# EAGLE design version4 (EAGLE 9.6.2)
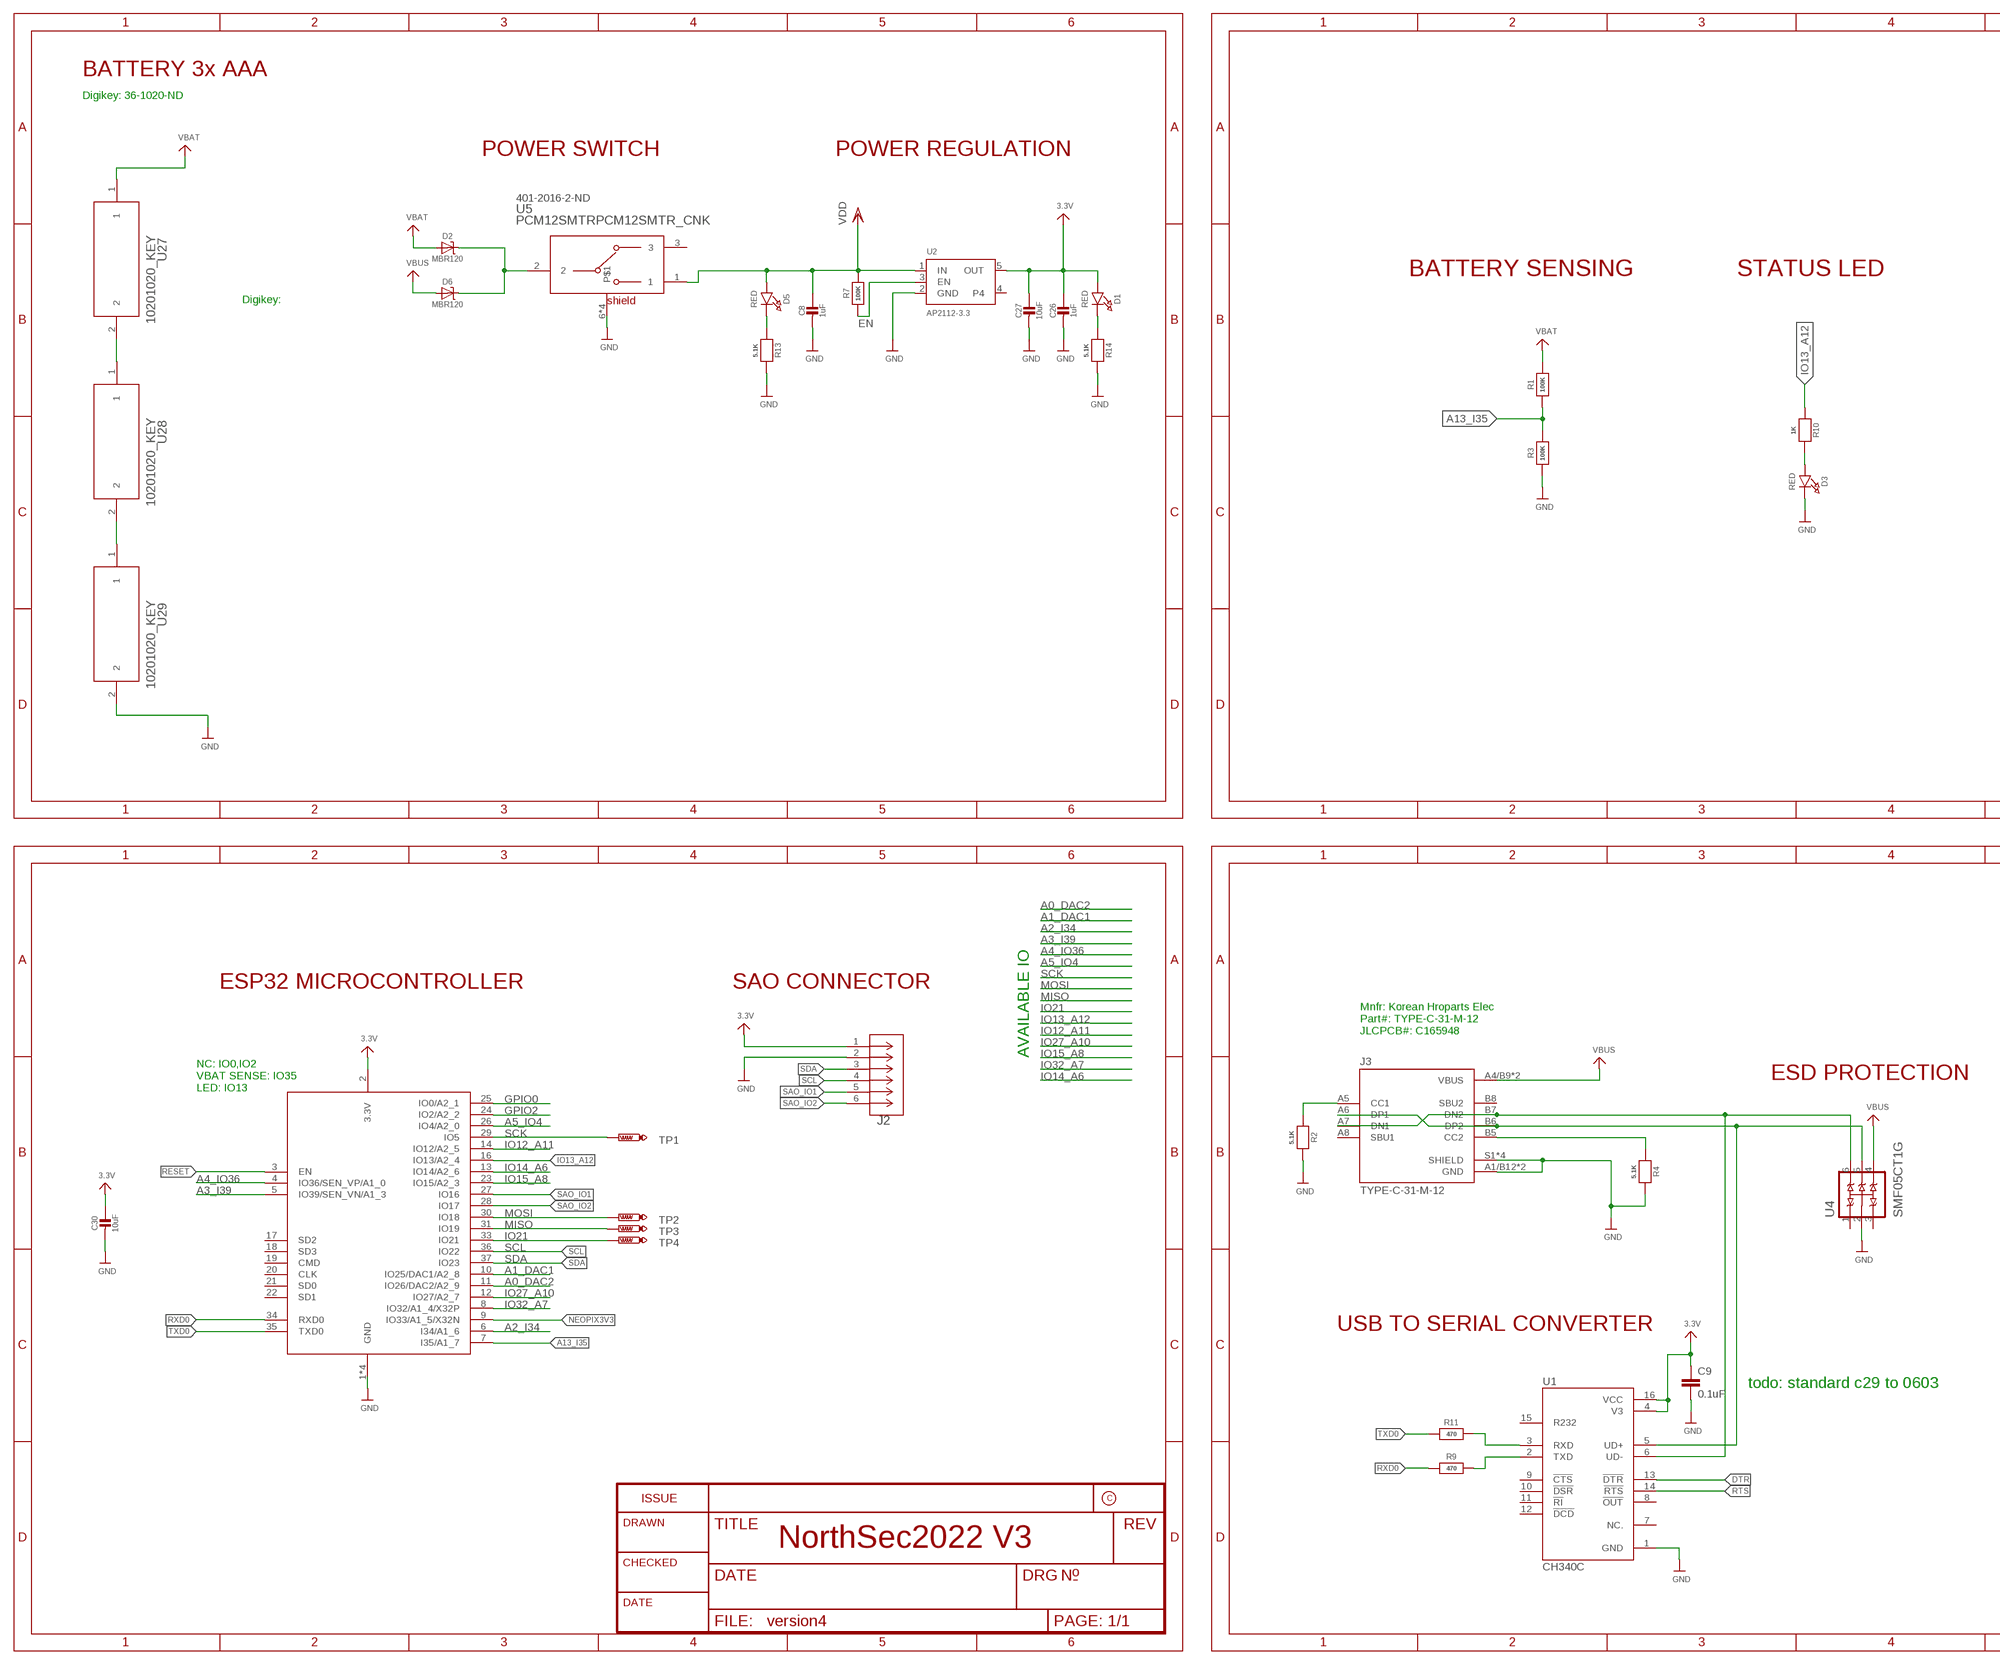
[diagram p0: schematic, sheet 1, part 1 of 2]
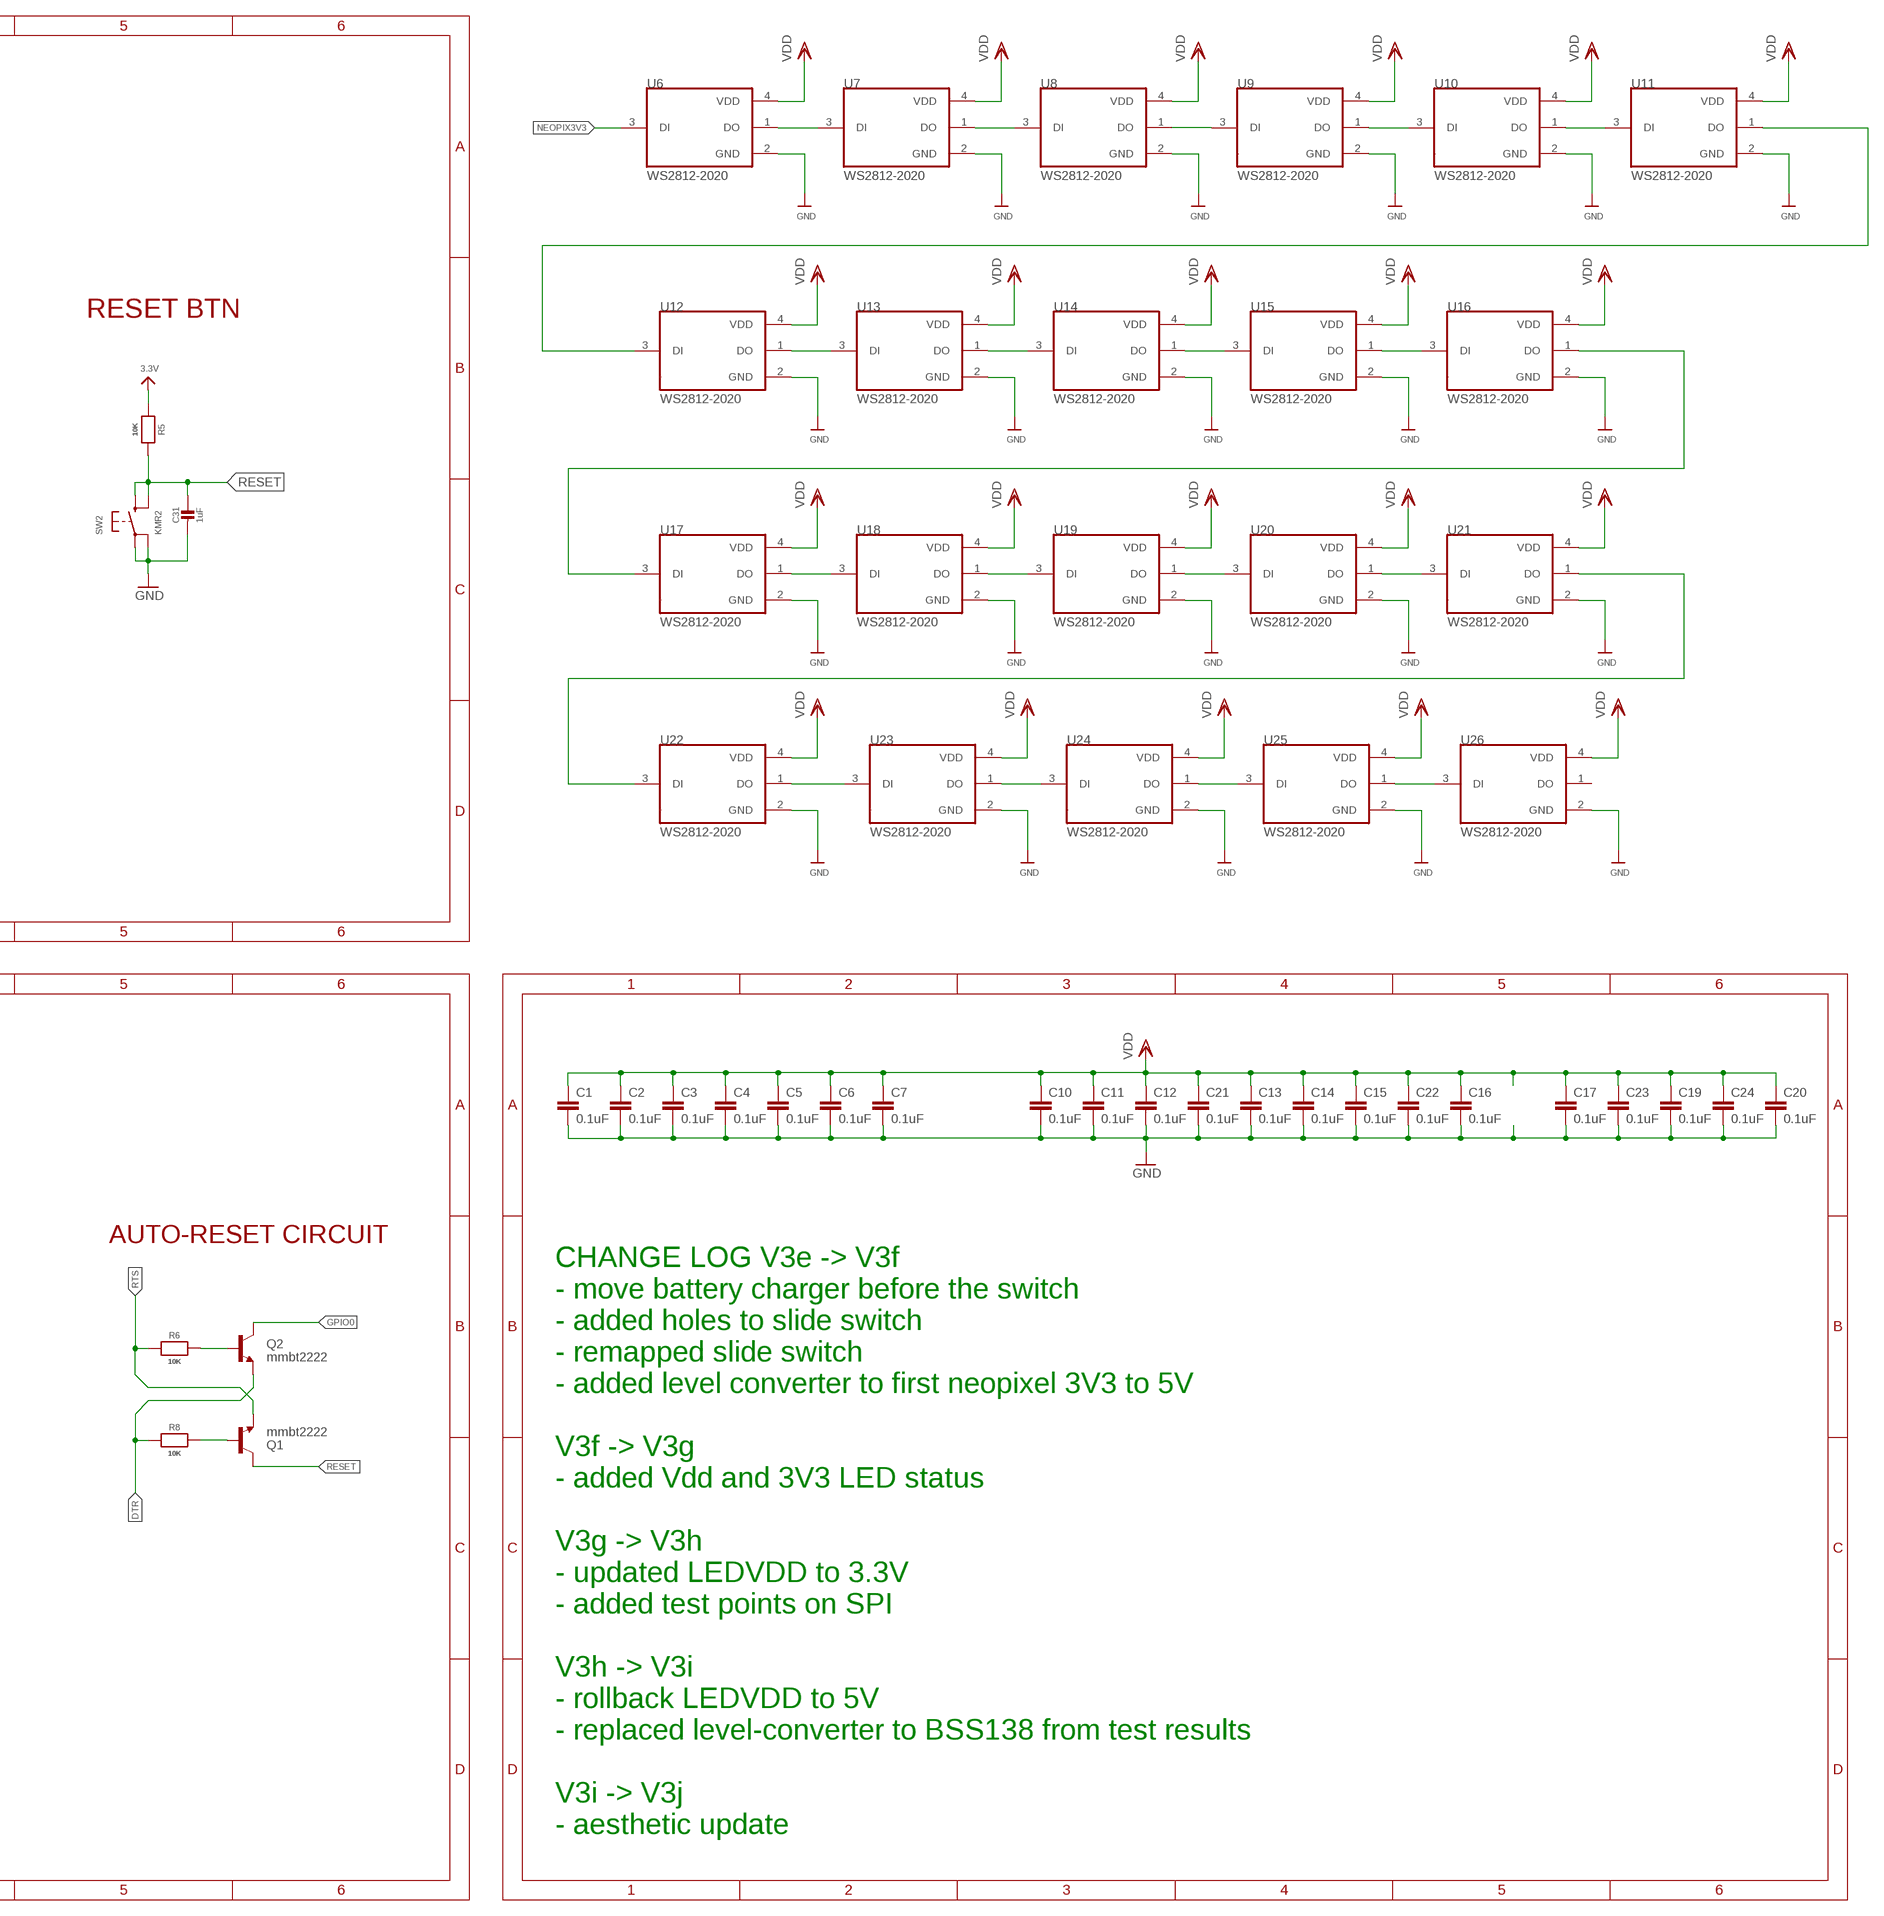
[diagram p1: schematic, sheet 1, part 2 of 2]

## Parts
C1  0.1uF  C-EUC0603  [C0603]
C2  0.1uF  C-EUC0603  [C0603]
C3  0.1uF  C-EUC0603  [C0603]
C4  0.1uF  C-EUC0603  [C0603]
C5  0.1uF  C-EUC0603  [C0603]
C6  0.1uF  C-EUC0603  [C0603]
C7  0.1uF  C-EUC0603  [C0603]
C8  1uF  CAP_CERAMIC0603_NO  [0603-NO]
C9  0.1uF  C-EUC0603  [C0603]
C10  0.1uF  C-EUC0603  [C0603]
C11  0.1uF  C-EUC0603  [C0603]
C12  0.1uF  C-EUC0603  [C0603]
C13  0.1uF  C-EUC0603  [C0603]
C14  0.1uF  C-EUC0603  [C0603]
C15  0.1uF  C-EUC0603  [C0603]
C16  0.1uF  C-EUC0603  [C0603]
C17  0.1uF  C-EUC0603  [C0603]
C19  0.1uF  C-EUC0603  [C0603]
C20  0.1uF  C-EUC0603  [C0603]
C21  0.1uF  C-EUC0603  [C0603]
C22  0.1uF  C-EUC0603  [C0603]
C23  0.1uF  C-EUC0603  [C0603]
C24  0.1uF  C-EUC0603  [C0603]
C26  1uF  CAP_CERAMIC0603_NO  [0603-NO]
C27  10uF  CAP_CERAMIC0805-NOOUTLINE  [0805-NO]
C30  10uF  CAP_CERAMIC0805-NOOUTLINE  [0805-NO]
C31  1uF  CAP_CERAMIC0603_NO  [0603-NO]
D1  RED  LED0805_NOOUTLINE  [CHIPLED_0805_NOOUTLINE]
D2  MBR120  DIODE-SCHOTTKYSOD-123  [SOD-123]
D3  RED  LED0805_NOOUTLINE  [CHIPLED_0805_NOOUTLINE]
D5  RED  LED0805_NOOUTLINE  [CHIPLED_0805_NOOUTLINE]
D6  MBR120  DIODE-SCHOTTKYSOD-123  [SOD-123]
J2  SSW-103-22-F-D-VS-K-TRCON3_SSW-D-DUMZ_HDR_SAI  [CON3_SSW-D-DUMZ_HDR_SAI]
J3  TYPE-C-31-M-12  [HRO_TYPE-C-31-M-12]
Q1  mmbt2222  TRANSISTOR_NPNSOT23-3  [SOT23-3]
Q2  mmbt2222  TRANSISTOR_NPNSOT23-3  [SOT23-3]
R1  100K  RESISTOR_0603_NOOUT  [0603-NO]
R2  5.1K  RESISTOR_0603_NOOUT  [0603-NO]
R3  100K  RESISTOR_0603_NOOUT  [0603-NO]
R4  5.1K  RESISTOR_0603_NOOUT  [0603-NO]
R5  10K  RESISTOR_0603_NOOUT  [0603-NO]
R6  10K  RESISTOR_0603_NOOUT  [0603-NO]
R7  100K  RESISTOR_0603_NOOUT  [0603-NO]
R8  10K  RESISTOR_0603_NOOUT  [0603-NO]
R9  470  RESISTOR_0603_NOOUT  [0603-NO]
R10  1K  RESISTOR_0603_NOOUT  [0603-NO]
R11  470  RESISTOR_0603_NOOUT  [0603-NO]
R13  5.1K  RESISTOR_0603_NOOUT  [0603-NO]
R14  5.1K  RESISTOR_0603_NOOUT  [0603-NO]
SW2  KMR2  SWITCH_TACT_SMT4.6X2.8  [BTN_KMR2_4.6X2.8]
TP1  PTR1B1,27  [B1,27]
TP2  PTR1B1,27  [B1,27]
TP3  PTR1B1,27  [B1,27]
TP4  PTR1B1,27  [B1,27]
U1  CH340C  [SOIC127P600X180-16N]
U2  AP2112-3.3  VREG_SOT23-5  [SOT23-5]
U4  SMF05CT1G  [SOT65P210X110-6N]
U5  PCM12SMTRPCM12SMTR_CNK  [PCM12SMTR_CNK]
U6  WS2812-2020  [LED_WS2812-2020]
U7  WS2812-2020  [LED_WS2812-2020]
U8  WS2812-2020  [LED_WS2812-2020]
U9  WS2812-2020  [LED_WS2812-2020]
U10  WS2812-2020  [LED_WS2812-2020]
U11  WS2812-2020  [LED_WS2812-2020]
U12  WS2812-2020  [LED_WS2812-2020]
U13  WS2812-2020  [LED_WS2812-2020]
U14  WS2812-2020  [LED_WS2812-2020]
U15  WS2812-2020  [LED_WS2812-2020]
U16  WS2812-2020  [LED_WS2812-2020]
U17  WS2812-2020  [LED_WS2812-2020]
U18  WS2812-2020  [LED_WS2812-2020]
U19  WS2812-2020  [LED_WS2812-2020]
U20  WS2812-2020  [LED_WS2812-2020]
U21  WS2812-2020  [LED_WS2812-2020]
U22  WS2812-2020  [LED_WS2812-2020]
U23  WS2812-2020  [LED_WS2812-2020]
U24  WS2812-2020  [LED_WS2812-2020]
U25  WS2812-2020  [LED_WS2812-2020]
U26  WS2812-2020  [LED_WS2812-2020]
U27  10201020_KEY  [1020_KEY]
U28  10201020_KEY  [1020_KEY]
U29  10201020_KEY  [1020_KEY]
X2  ESP32_WROOM32_SKINNY  [WROOM32_SKINNY]

## Nets
3.3V: C9.1 C26.1 C27.1 C30.1 D1.A J2.1 R5.1 U1.4(V3) U1.16(VCC) U2.5(OUT) X2.2(3.3V)
A0_DAC2: X2.11(IO26/DAC2/A2_9)
A1_DAC1: X2.10(IO25/DAC1/A2_8)
A2_I34: X2.6(I34/A1_6)
A3_I39: X2.5(IO39/SEN_VN/A1_3)
A4_IO36: X2.4(IO36/SEN_VP/A1_0)
A5_IO4: X2.26(IO4/A2_0)
A13_I35: R1.1 R3.2 X2.7(I35/A1_7)
DTR: Q2.2(E) R8.1 U1.13(!DTR)
EN: R7.1 U2.3(EN)
GND: C1.2 C2.2 C3.2 C4.2 C5.2 C6.2 C7.2 C8.2 C9.2 C10.2 C11.2 C12.2 C13.2 C14.2 C15.2 C16.2 C17.2 C19.2 C20.2 C21.2 C22.2 C23.2 C24.2 C26.2 C27.2 C30.2 C31.2 D3.C J2.2 J3.A1/B12(GND) J3.B1/A12(GND) J3.S1(SHIELD) J3.S2(SHIELD) J3.S3(SHIELD) J3.S4(SHIELD) R2.2 R3.1 R4.2 R13.2 R14.2 SW2.A'(P1) SW2.A(P) U1.1(GND) U2.2(GND) U4.2(A) U5.6 U5.7 U5.8 U5.9 U6.2(GND) U7.2(GND) U8.2(GND) U9.2(GND) U10.2(GND) U11.2(GND) U12.2(GND) U13.2(GND) U14.2(GND) U15.2(GND) U16.2(GND) U17.2(GND) U18.2(GND) U19.2(GND) U20.2(GND) U21.2(GND) U22.2(GND) U23.2(GND) U24.2(GND) U25.2(GND) U26.2(GND) U29.2 X2.1(GND) X2.15(GND) X2.38(GND) X2.P$1(GND)
GPIO0: Q2.3(C) X2.25(IO0/A2_1)
GPIO2: X2.24(IO2/A2_2)
IO12_A11: X2.14(IO12/A2_5)
IO13_A12: R10.1 X2.16(IO13/A2_4)
IO14_A6: X2.13(IO14/A2_6)
IO15_A8: X2.23(IO15/A2_3)
IO21: TP4.TP X2.33(IO21)
IO27_A10: X2.12(IO27/A2_7)
IO32_A7: X2.8(IO32/A1_4/X32P)
MISO: TP3.TP X2.31(IO19)
MOSI: TP2.TP X2.30(IO18)
N$1: U7.1(DO) U8.3(DI)
N$2: U8.1(DO) U9.3(DI)
N$3: U23.1(DO) U24.3(DI)
N$4: U24.1(DO) U25.3(DI)
N$5: U25.1(DO) U26.3(DI)
N$6: J3.B5(CC2) R4.1
N$7: D2.C D6.C U5.2
N$8: J3.A5(CC1) R2.1
N$9: U22.1(DO) U23.3(DI)
N$10: U28.2 U29.1
N$11: U27.2 U28.1
N$26: R9.2 U1.2(TXD)
N$28: J3.A6(DP1) J3.B6(DP2) U1.5(UD+) U4.5(C4)
N$29: J3.A7(DN1) J3.B7(DN2) U1.6(UD-) U4.6(C5)
N$30: Q1.1(B) R8.2
N$31: Q2.1(B) R6.2
N$32: R11.2 U1.3(RXD)
N$33: D3.A R10.2
N$35: D5.C R13.1
N$36: D1.C R14.1
N$38: U6.1(DO) U7.3(DI)
N$40: U9.1(DO) U10.3(DI)
N$41: U10.1(DO) U11.3(DI)
N$42: U11.1(DO) U12.3(DI)
N$43: U12.1(DO) U13.3(DI)
N$44: U13.1(DO) U14.3(DI)
N$45: U14.1(DO) U15.3(DI)
N$46: U15.1(DO) U16.3(DI)
N$47: U16.1(DO) U17.3(DI)
N$48: U17.1(DO) U18.3(DI)
N$49: U18.1(DO) U19.3(DI)
N$50: U19.1(DO) U20.3(DI)
N$51: U20.1(DO) U21.3(DI)
N$52: U21.1(DO) U22.3(DI)
NEOPIX3V3: U6.3(DI) X2.9(IO33/A1_5/X32N)
RESET: C31.1 Q1.3(C) R5.2 SW2.B'(S1) SW2.B(S) X2.3(EN)
RTS: Q1.2(E) R6.1 U1.14(!RTS)
RXD0: R9.1 X2.34(RXD0)
SAO_IO1: J2.5 X2.27(IO16)
SAO_IO2: J2.6 X2.28(IO17)
SCK: TP1.TP X2.29(IO5)
SCL: J2.4 X2.36(IO22)
SDA: J2.3 X2.37(IO23)
TXD0: R11.1 X2.35(TXD0)
VBAT: D2.A R1.2 U27.1
VBUS: D6.A J3.A4/B9(VBUS) J3.B4/A9(VBUS) U4.4(C3)
VDD: C1.1 C2.1 C3.1 C4.1 C5.1 C6.1 C7.1 C8.1 C10.1 C11.1 C12.1 C13.1 C14.1 C15.1 C16.1 C17.1 C19.1 C20.1 C21.1 C22.1 C23.1 C24.1 D5.A R7.2 U2.1(IN) U5.1 U6.4(VDD) U7.4(VDD) U8.4(VDD) U9.4(VDD) U10.4(VDD) U11.4(VDD) U12.4(VDD) U13.4(VDD) U14.4(VDD) U15.4(VDD) U16.4(VDD) U17.4(VDD) U18.4(VDD) U19.4(VDD) U20.4(VDD) U21.4(VDD) U22.4(VDD) U23.4(VDD) U24.4(VDD) U25.4(VDD) U26.4(VDD)
Unconnected: J3.A8(SBU1) J3.B8(SBU2) U1.7(NC.) U1.8(!OUT) U1.9(!CTS) U1.10(!DSR) U1.11(!RI) U1.12(!DCD) U1.15(R232) U2.4 U4.1(C1) U4.3(C2) U5.3 U26.1(DO) X2.17(SD2) X2.18(SD3) X2.19(CMD) X2.20(CLK) X2.21(SD0) X2.22(SD1)

## Notes on the sheet
- BATTERY 3x AAA
- Digikey: 36-1020-ND
- POWER SWITCH | POWER REGULATION
- 401-2016-2-ND
- BATTERY SENSING | STATUS LED | RESET BTN
- Digikey:
- ESP32 MICROCONTROLLER | SAO CONNECTOR
- Mnfr: Korean Hroparts Elec
  Part#: TYPE-C-31-M-12
  JLCPCB#: C165948
- AVAILABLE IO
- ESD PROTECTION | AUTO-RESET CIRCUIT
- NC: IO0,IO2
  VBAT SENSE: IO35
  LED: IO13
- USB TO SERIAL CONVERTER
- todo: standard c29 to 0603
- NorthSec2022 V3
- CHANGE LOG V3e -> V3f
  - move battery charger before the switch
  - added holes to slide switch
  - remapped slide switch
  - added level converter to first neopixel 3V3 to 5V
  
  V3f -> V3g
  - added Vdd and 3V3 LED status
  
  V3g -> V3h
  - updated LEDVDD to 3.3V
  - added test points on SPI
  
  V3h -> V3i
  - rollback LEDVDD to 5V
  - replaced level-converter to BSS138 from test results
  
  V3i -> V3j
  - aesthetic update

## Library data of the parts
C1-C7 C9-C17 C19-C24 = rcl:C-EU: CAPACITOR, European symbol
C8 C26 C27 C30 C31 = microbuilder:CAP_CERAMIC: Ceramic Capacitors For new designs, use the packages preceded by an '_' character since they are more reliable: The following footprints should be used on most boards: _0402 - Standard footprint for regular board layouts _0603 - Standard footprint for regular board layouts _0805 - Standard footprint for regular board layouts _1206 - Standard footprint for regular board layouts For extremely tight-pitch boards where space is at a premium, the following 'micro-pitch' footprints can be used (smaller pads, no silkscreen outline, etc.): _0402MP - Micro-pitch footprint for very dense/compact boards _0603MP - Micro-pitch footprint for very dense/compact boards _0805MP - Micro-pitch footprint for very dense/compact boards _1206MP - Micro-pitch footprint for very dense/compact boards
D1 D3 D5 = microbuilder:LED: LED 0603 - 0603 Surface Mount Package 2mA: Green LED - Low Power (3.9mcd, 2ma, 1.7Vf) - Digikey: 475-2709-2-ND Orange LED - Low Power (9.8mcd, 2ma, 1.8Vf) - Digikey: 475-1194-2-ND Red LED - Low Power (5mcd, 2ma, 1.8Vf) - Digikey: 475-1195-2-ND Yellow LED - Low Power (7mcd, 2ma, 1.8Vf) - Digikey: 475-1196-2-ND 5mA: Blue LED - Low Power (17mcd, 5ma, 2.9Vf) - Digikey: LNJ937W8CRACT-ND 0805 - 0805 Surface Mount Package 2mA: Red LED (8.8mcd, 2mA, 1.8Vf, Clear) - Low Power [Digikey: 475-2510-1-ND] Green LED (5mcd, 2mA, 1.8Vf, Clear) - Low Power [Digikey: 475-2730-1-ND] Yellow LED (11.3mcd, 2mA, 1.8Vf, Clear) - Low Power [Digikey: 475-2555-1-ND] 20mA: Red LED (104mcd, 20mA, Diffused) - LS R976 [Digikey: 475-1278-6-ND] Red LED (12mcd, 20mA, 2.0Vf, Clear) - APT2012EC [Digikey: 754-1128-1-ND] Green LED (15mcd, 20mA, 2.2Vf, Clear) - APT2012GC [Digikey: 754-1131-1-ND] Orange LED (160mcd, 20mA, 2.1Vf, Clear) - APT2012SECK [Digikey: 754-1130-1-ND] 1206 - 1206 Surface Mount Package Green LED (26mcd, 20mA, Diffused) - LG N971 [Digikey: 475-1407-6-ND] Red LED (15mcd, 20mA, Diffused) - LH N974 [Digikey: 475-1416-6-ND] Cree - Cree High-Power Surface Mount LEDs XPEBWT-L1-0000-00D50 - White 111lm 350mA 2.9Vf 6200K 110° XTEAWT-00-0000-00000LEE3 - White 114lm 350mA 2.85Vf 5000K 115° Everlight - Everlight 45-21 Series Surface Mount LEDs 45-21/QK2C-B2832AC2CB2/2T - Warm White 2000mcd 20mA 3.25Vf 3050K 120° 45-21/LK2C-B38452C4CB2/2T - Nuetral White 2000mcd 20mA 3.25Vf 4150K 120° 45-21/LK2C-B50634C6CB2/2T - Cold White 2200mcd 20mA 3.25Vf 5650K 120° PLCC2 Reverse Mount LS T77K-J1L2-1-0-2-R18-Z - Red 11.25mcd 2mA 1.8Vf 630nm 120° LO T77K-L1M2-24-Z - Orange 19.6mcd 2mA 1.8Vf 606nm 120° LY T77K-K2M1-26-Z - Yellow 15.7mcd 2mA 1.8Vf 587nm 120°
D2 D6 = microbuilder:DIODE-SCHOTTKY
J2 = SSW-103-22-F-D-VS-K-TR:SSW-103-22-F-D-VS-K-TR; COPYRIGHT: Copyright (C) 2022 Ultra Librarian. All rights reserved.; DIGI-KEY_PART_NUMBER_1: SAM14622CT-ND; DIGI-KEY_PART_NUMBER_2: SAM14622DKR-ND; DIGI-KEY_PART_NUMBER_3: SAM14622TR-ND; MANUFACTURER_PART_NUMBER: SSW-103-22-F-D-VS-K-TR; MFR_NAME: Samtec Inc
J3 = TYPE-C-31-M-12:TYPE-C-31-M-12; MANUFACTURER: HRO Electronics Co., Ltd.; MAXIMUM_PACKAGE_HEIGHT: 3.26 mm; PARTREV: 2020.12.08; SNAPEDA_PN: TYPE-C-31-M-12; STANDARD: Manufacturer Recommendations
Q1 Q2 = SparkFun:TRANSISTOR_NPN: Transistor NPN BJT configuration in SOT23 package. MMBT2222 is the common NPN we use. Double check BCE configuration again layout.
R1-R11 R13 R14 = microbuilder:RESISTOR: Resistors For new designs, use the packages preceded by an '_' character since they are more reliable: The following footprints should be used on most boards: _0402 - Standard footprint for regular board layouts _0603 - Standard footprint for regular board layouts _0805 - Standard footprint for regular board layouts _1206 - Standard footprint for regular board layouts For extremely tight-pitch boards where space is at a premium, the following 'micro-pitch' footprints can be used (smaller pads, no silkscreen outline, etc.): _0402MP - Micro-pitch footprint for very dense/compact boards _0603MP - Micro-pitch footprint for very dense/compact boards _0805MP - Micro-pitch footprint for very dense/compact boards _1206MP - Micro-pitch footprint for very dense/compact boards
SW2 = microbuilder:SWITCH_TACT_SMT: SMT Tact Switches 6x6mm - Digikey: P12940SCT-ND KMR2 (4.6x2.8mm) - Digikey: 401-1426-1-ND EVQ-PQHB55 - Light Touch, 160GF (4.5x4.5mm) - Digikey: P8090SCT-ND KMT0 - KMT021 NGJ LHS (etc.) IP68/Waterproof - Digikey: CKN10289CT-ND
TP1-TP4 = testpad:PTR1: TEST PIN
U1 = CH340C:CH340C: USB to serial chip CH340 Check prices <https://pricing.snapeda.com/parts/CH340C/WCH/view-part?ref=eda>; AVAILABILITY: Not in stock; DESCRIPTION: USB to serial chip CH340; MF: WCH; MP: CH340C; PACKAGE: None; PRICE: None
U2 = microbuilder:VREG_SOT23-5: SOT23-5 Fixed Voltage Regulators Part Current Out V Out V In V Dropout θJA (°C/W) TJ (°C) Digikey Part No. ADP121 150mA 3.3V 3.4-5.5V 0.09V @ 150mA -- -- ADP121-AUJZ33R7CT-ND ADP121 150mA 3.0V 3.1-5.5V 0.09V @ 150mA -- -- ADP121-AUJZ30R7CT-ND ADP122 300mA 3.3V 3.4-5.5V 0.085V @ 300mA -- -- ADP122AUJZ-3.3-R7CT-ND ADP1712 300mA 3.3V 3.5-5.5V 0.17V @ 300mA -- -- ADP1712AUJZ-3.3-R7TR-ND AP7311 (Low Cost) 150mA 3.3V 3.5-6V 0.15V @ 150mA -- -- AP7311-33WG-7DICT-ND LD39015M18R 150mA 1.8V 1.9V-5.5V 0.08V @ 100mA -- -- 497-6977-1-ND LP2985A-33DBVR 150mA 3.3V 3.3-16V 0.28V @ 150mA 206 150 296-18479-1-ND MCP1824T-3302E/OT 300mA 3.3V 3.5V-6V 0.2V @ 300mA -- -- MCP1824T-3302E/OTCT-ND MIC5205-2.5YM5 TR 150mA 2.5V 2.7-16V 0.165V @ 150mA -- -- 576-1257-2-ND MIC5205-3.0YM5 TR 150mA 3.0V 3.2V-16V 0.165V @ 150mA -- -- 576-1258-2-ND MIC5205-3.3YM5 TR 150mA 3.3V 3.5V-16V 0.165V @ 150mA -- -- 576-1259-2-ND TPS780330220 150mA 3.3V+2.2V 3.6-5.5V 250mV Max -- -- 296-23332-1-ND TDA3663/N1,135 100mA 3.3V 3.5-45V 0.18V @ 50mA -- -- 568-5343-1-ND Max operating temp can be calculated using θJA, TJ (max junction temperature), and power in watts. Set the "Maximum Ambient Temperature" until it reaches TJ ("Max Junction Temperature"), which is the absolute limit for safe use of the regulator: Heat Sink Temperature Calculator <http://www.daycounter.com/Calculators/Heat-Sink-Temperature-Calculator.phtml> For example, With 12V source into a 3.3V LP2985 and a 30mA load, we are dissipating (12V-3.3V) * 0.03A = 0.261W. With a θJA of 206 °C/W, a TJ of 150°C, and 261mW we can safely use the chip without a heat sink up to 75°C (=147.1°C Junction Temperature).
U4 = SMF05CT1G:SMF05CT1G: SMF05C Series 7.2 V 100 W 5-Line Transient Voltage Suppressor Array - SC-88 Check prices <https://pricing.snapeda.com/parts/SMF05CT1G/ON%20Semiconductor/view-part?ref=eda>; AVAILABILITY: In Stock; DESCRIPTION: 12.5V Clamp 8A (8/20µs) Ipp Tvs Diode Surface Mount SC-88/SC70-6/SOT-363; MF: ON Semiconductor; MP: SMF05CT1G; PACKAGE: SC-88-6 ON Semiconductor; PRICE: None; PURCHASE-URL: https://pricing.snapeda.com/search/part/SMF05CT1G/?ref=eda
U5 = 401-2016-2-ND:PCM12SMTR; COPYRIGHT: Copyright (C) 2022 Ultra Librarian. All rights reserved.; DIGI-KEY_PART_NUMBER_1: 401-2016-2-ND; DIGI-KEY_PART_NUMBER_2: 401-2016-1-ND; DIGI-KEY_PART_NUMBER_3: 401-2016-6-ND; DIGI-KEY_PART_NUMBER_4: 2266-PCM12SMTR-ND; MANUFACTURER_PART_NUMBER: PCM12SMTR; MFR_NAME: C&K
U6-U26 = WS2812-2020:WS2812-2020: Intelligent control LED integrated light source Check availability <https://pricing.snapeda.com/parts/WS2812-2020/Worldsemi/view-part?ref=eda>; AVAILABILITY: Not in stock; DESCRIPTION: Intelligent control LED light source, SMD-4; MF: Worldsemi; MP: WS2812-2020; PACKAGE: Package; PRICE: None
U27-U29 = 36-1020-ND:1020; COPYRIGHT: Copyright (C) 2022 Ultra Librarian. All rights reserved.; DIGI-KEY_PART_NUMBER_1: 1020K-ND; DIGI-KEY_PART_NUMBER_2: 1528-2635-ND; DIGI-KEY_PART_NUMBER_3: 290-1966-ND; DIGI-KEY_PART_NUMBER_4: 2991-1020-ND; DIGI-KEY_PART_NUMBER_5: 36-1020-ND; MANUFACTURER_PART_NUMBER: 1020; MFR_NAME: Keystone Electronics
X2 = microbuilder:ESP32_WROOM32

## Net classes
1 vcc: width 0.254 mm

## Board
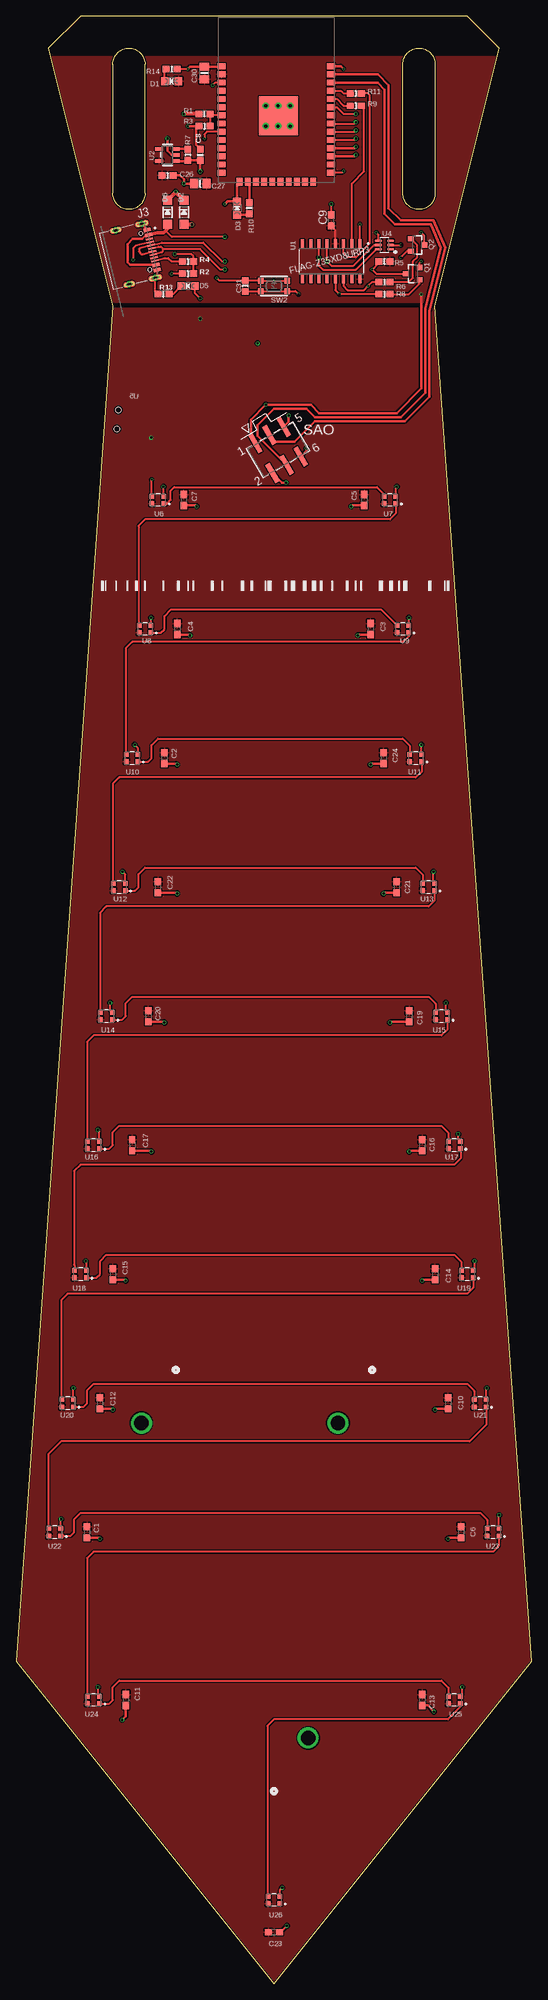
[diagram p2: board, top side]
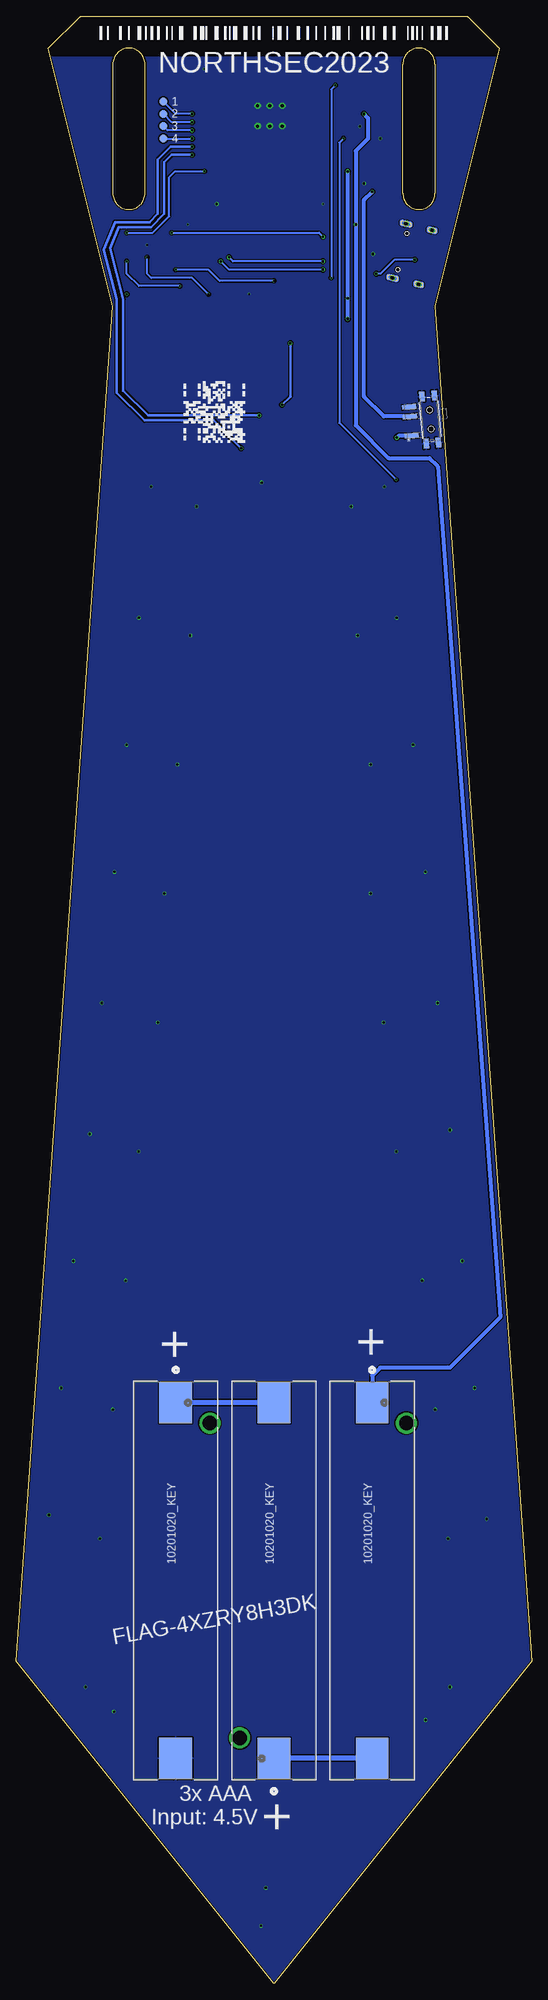
[diagram p3: board, bottom side, seen from below]

Size 80 x 305 mm. Coordinates in mm from the lower left corner, seen from the top.
Outline: 15,260 0,50 40,0 80,50 65,260 75,300 70,305 10,305 5,300 15,260
Outline: 15,297.54 15,277.54 arc180 20,277.54 20,297.54 arc180 15,297.54
Outline: 65,297.54 65,277.54 arc-180 60,277.54 60,297.54 arc-180 65,297.54
Copper layers (1*16): Top 0.035mm / dielectric 0.2mm / Bottom 0.035mm
Design rules "JLC_2Layer_(workInProgress)": minimum track width 3.5mil, minimum drill 0.2mm, track to track 3.5mil, track to pad 5mil, pad to pad 5mil, via to via 5mil, smd to smd 0mil, copper to edge 0.2mm, drill to drill 0.2mm, minimum pad ring 3mil, minimum via ring 3mil, stop-mask expansion 0mil, vias tented up to drill 100mil, thermal gap 10mil

### Footprints (pad centres in the part's own frame; a part is rotated, then mirrored left to right if it is on the bottom)
C0603 = smd 1.1 x 1: 1 -0.85,0; 2 0.85,0
0603-NO = smd 1.075 x 1: 1 -0.85,0; 2 0.85,0
0805-NO = smd 1.24 x 1.5: 1 -0.95,0; 2 0.95,0
CHIPLED_0805_NOOUTLINE = smd 1.2 x 1.2: A 0,-1.05; C 0,1.05
SOD-123 = smd 1.4 x 1.4: A 1.85,0; C -1.85,0
CON3_SSW-D-DUMZ_HDR_SAI = smd 0.737 x 3.251: 1 2.54,-2.667; 2 2.54,2.667; 3 0,-2.667; 4 0,2.667; 5 -2.54,-2.667; 6 -2.54,2.667
HRO_TYPE-C-31-M-12 = smd 0.6 x 1.14: A1/B12 -3.2,4.75; A4/B9 -2.4,4.75; B1/A12 3.2,4.75; B4/A9 2.4,4.75 | smd 0.3 x 1.14: A5 -1.25,4.75; A6 -0.25,4.75; A7 0.25,4.75; A8 1.25,4.75; B5 1.75,4.75; B6 0.75,4.75; B7 -0.75,4.75; B8 -1.75,4.75 | drill 0.6 pad 0.9: S1 -4.325,4.17; S2 4.325,4.17; S3 -4.325,0; S4 4.325,0 | hole 0.6: -2.89,3.68; 2.89,3.68
SOT23-3 = smd 0.8 x 0.9: 1 -0.95,-1; 2 0.95,-1; 3 0,1.1
BTN_KMR2_4.6X2.8 = smd 0.9 x 0.9: A 2.05,0.8; A' -2.05,0.8; B 2.05,-0.8; B' -2.05,-0.8
B1,27 = smd 1.27 x 1.27: TP 0,0
SOIC127P600X180-16N = smd 1.31 x 0.62: 1 -2.75,4.445; 2 -2.75,3.175; 3 -2.75,1.905; 4 -2.75,0.635; 5 -2.75,-0.635; 6 -2.75,-1.905; 7 -2.75,-3.175; 8 -2.75,-4.445; 9 2.75,-4.445; 10 2.75,-3.175; 11 2.75,-1.905; 12 2.75,-0.635; 13 2.75,0.635; 14 2.75,1.905; 15 2.75,3.175; 16 2.75,4.445
SOT23-5 = smd 0.55 x 1.2: 1 -0.95,-1.3; 2 0,-1.3; 3 0.95,-1.3; 4 0.95,1.3; 5 -0.95,1.3
SOT65P210X110-6N = smd 1.06 x 0.39: 1 -0.935,0.65; 2 -0.935,0; 3 -0.935,-0.65; 4 0.935,-0.65; 5 0.935,0; 6 0.935,0.65
PCM12SMTR_CNK = smd 2.21 x 0.762: 1 3.101,2.25; 2 3.101,-0.75; 3 3.101,-2.25 | smd 0.813 x 1.524: 6 -0.965,3.65; 7 0.965,3.65; 8 -0.965,-3.65; 9 0.965,-3.65 | hole 0.9: 0,1.499; 0,-1.499
LED_WS2812-2020 = smd 0.7 x 0.7: 1 -0.915,0.55; 2 -0.915,-0.55; 3 0.915,-0.55; 4 0.915,0.55
1020_KEY = smd 6.35 x 5.08: 1 -27.572,0; 2 27.572,0 | drill 2.235 pad 2.235: 3 -24.397,5.309
WROOM32_SKINNY = smd 1.2 x 0.9: 1 -8.5,5; 2 -8.5,3.73; 3 -8.5,2.46; 4 -8.5,1.19; 5 -8.5,-0.08; 6 -8.5,-1.35; 7 -8.5,-2.62; 8 -8.5,-3.89; 9 -8.5,-5.16; 10 -8.5,-6.43; 11 -8.5,-7.7; 12 -8.5,-8.97; 13 -8.5,-10.24; 14 -8.5,-11.51; 25 8.5,-11.51; 26 8.5,-10.24; 27 8.5,-8.97; 28 8.5,-7.7; 29 8.5,-6.43; 30 8.5,-5.16; 31 8.5,-3.89; 32 8.5,-2.62; 33 8.5,-1.35; 34 8.5,-0.08; 35 8.5,1.19; 36 8.5,2.46; 37 8.5,3.73; 38 8.5,5 | smd 0.9 x 1.2: 15 -5.7,-12.9; 16 -4.43,-12.9; 17 -3.16,-12.9; 18 -1.89,-12.9; 19 -0.62,-12.9; 20 0.65,-12.9; 21 1.92,-12.9; 22 3.19,-12.9; 23 4.46,-12.9; 24 5.73,-12.9 | smd 6 x 6: P$1 0.34,-2.7

### Placement (x,y rotation side)
C1  11,70 270 top
C2  23,190 270 top
C3  55,210 270 top
C4  25,210 270 top
C5  54,230 270 top
C6  69,70 270 top
C7  26,230 270 top
C8  28.57,283.49 90 top
C9  48.89,273.33 90 top
C10  67,90 270 top
C11  17,44 270 top
C12  13,90 270 top
C13  63,44 270 top
C14  65,110 270 top
C15  15,110 270 top
C16  63,130 270 top
C17  18,130 270 top
C19  61,150 270 top
C20  20.5,150 270 top
C21  59,170 270 top
C22  22,170 270 top
C23  40,8 0 top
C24  57,190 270 top
C26  23.49,280.31 0 top
C27  28.57,279.05 180 top
C30  29.2,296.19 90 top
C31  35.55,263.17 270 top
D1  24.12,294.92 90 top
D2  26.03,274.6 270 top
D3  34.28,275.24 0 top
D5  26.66,263.17 90 top
D6  23.49,274.6 270 top
J2  40.63,237.77 210 top
J3  16.5,267.62 284 top
Q1  61.59,265.07 90 top
Q2  62.23,269.52 270 top
R1  29.2,289.84 180 top
R2  26.66,265.07 0 top
R3  29.2,287.94 0 top
R4  26.66,266.98 0 top
R5  57.14,266.98 180 top
R6  57.14,263.81 0 top
R7  26.66,283.49 270 top
R8  57.14,261.9 0 top
R9  52.7,291.11 0 top
R10  36.19,275.24 270 top
R11  52.7,293.01 0 top
R13  22.86,261.9 180 top
R14  24.12,296.82 0 top
SW2  40,263.17 180 top
TP1  57.14,286.03 0 bottom
TP2  57.14,287.94 0 bottom
TP3  57.14,289.84 0 bottom
TP4  57.14,291.75 0 bottom
U1  48.89,266.98 270 top
U2  23.49,283.49 90 top
U4  57.14,269.52 180 top
U5  15.74,242.47 185 bottom
U6  22,230 180 top
U7  58,230 180 top
U8  20,210 180 top
U9  60,210 180 top
U10  18,190 180 top
U11  62,190 180 top
U12  16,170 180 top
U13  64,170 180 top
U14  14,150 180 top
U15  66,150 180 top
U16  12,130 180 top
U17  68,130 180 top
U18  10,110 180 top
U19  70,110 180 top
U20  8,90 180 top
U21  72,90 180 top
U22  6,70 180 top
U23  74,70 180 top
U24  12,44 180 top
U25  68,44 180 top
U26  40,13 180 top
U27  24.76,62.51 270 bottom
U28  40,62.51 90 bottom
U29  55.24,62.51 270 bottom
X2  40.36,292.24 0 top

### Tracks (layer width: path | path; a pad name or v marks a point on that pad's centre or on a via)
3.3V  (via drill 0.35)
  Top 0.254: C26.1 22.64,279.93
  Top 0.305: U1.4 49.52,271.85 C9.1
  Top 0.406: J2.1 36.7,239.21 36.7,239.8 36.44,240.06 36.44,242.47 v38.73,244.75 45.72,244.75 46.98,243.49 59.05,243.49 62.86,247.3 v62.86,261.9
  Bottom 0.406: v37.46,254.28 37.46,246.03 v38.73,244.75
  pour Top (isolate 0.203): -4.45,260.63 81.91,260.63 81.91,298.73 -4.45,298.73
A13_I35
  Top 0.305: X2.7 30.27,289.62 R1.1 R3.2
DTR  (via drill 0.25)
  Top 0.305: U1.13 49.52,262.53 v50.16,261.9 R8.1 | v59.69,267.62 60.64,268.57 Q2.2
  Bottom 0.305: v50.16,261.9 52.7,264.44 59.05,264.44 59.69,265.07 v59.69,267.62
EN
  Top 0.406: U2.3 26.56,284.44 R7.1
GND  (via drill 0.25, 0.35, 0.5 pad 1)
  Top 0.305: C31.2 37.9,262.32 SW2.A SW2.A' 43.34,262.37 v43.81,261.9 | U1.1 v53.34,272.69 | U4.2 v59.69,269.52 | v40.63,287.94 40.7,288 X2.P$1 | R14.2 v26.66,296.82 | R13.2 21.6,262.31 J3.S2 21.89,264.72 J3.B1/A12 | J3.A1/B12 19.5,272.7 J3.S1 | R2.2 R4.2 27.52,267.78 27.17,268.12 v24.63,268.12 | U26.2 40.91,14.53 v41.27,14.88 | U25.2 69.21,44.84 v69.21,46 | U24.2 12.7,44.77 v12.7,46 | U22.2 6.91,71.97 v6.98,72.03 | U20.2 8.89,90.58 v8.89,92.35 | U18.2 10.91,111.91 v10.79,112.04 | U16.2 12.91,132.14 v12.7,132.36 | U14.2 14.6,150.87 v14.6,152.04 | U12.2 16.91,171.96 v16.5,172.37 | U10.2 18.91,191.55 v18.41,192.05 | U8.2 20.91,211.7 v20.95,211.74 | U6.2 22.86,230.61 v22.86,232.06 | U7.2 58.91,231.92 v59.05,232.06 | U9.2 60.91,211.69 v60.95,211.74 | U11.2 62.86,190.61 v62.86,192.05 | U13.2 64.77,170.7 v64.77,172.37 | U15.2 66.67,150.79 v66.67,152.04 | U17.2 68.58,130.89 v68.58,131.72 | v71.11,112.04 71.11,110.75 U19.2 | U21.2 72.91,92.25 v73.02,92.35 | U23.2 v74.91,72.66 v74.92,72.67 | C9.2 v48.89,275.87
  Top 0.406: C2.2 24.85,189.15 v25,189 | C4.2 26.85,209.15 v27,209 | C7.2 27.85,229.15 v28,229 | C22.2 25,169.15 v25,169 | C17.2 21,129.15 v21,129 | C15.2 17,109.15 v17,109 | C12.2 14.85,89.15 v15,89 | C1.2 12.85,69.15 v13,69 | C11.2 17,41.46 v16.46,40.92 | C20.2 23,149.15 v23,149 | v64.81,42.19 63.85,43.15 C13.2 | C23.2 41,8 v42,9 | C16.2 61.15,129.15 v61,129 | C19.2 58.15,149.15 v58,149 | C14.2 63.15,109.15 v63,109 | C6.2 67.15,69.15 v67,69 | C10.2 65.15,89.15 v65,89 | C21.2 57.15,169.15 v57,169 | C24.2 55.15,189.15 v55,189 | C3.2 53.15,209.15 v53,209 | C5.2 52.15,229.15 v52,229 | C26.2 25.39,280.31 26.03,279.68 v26.03,279.05 C27.2 | X2.15 34.28,278.97 D3.C 32.8,276.29 v32.38,275.87 | U2.2 24.12,283.49 23.49,284.12 v23.49,286.03 | v26.66,287.94 R3.1 27.94,287.51 27.94,285.07 C8.2 | X2.1 31.76,297.14 C30.2 26.98,297.14 v26.66,296.82 | X2.38 50.38,297.24 v50.8,296.82 | J2.2 41.27,232.69 v41.91,232.69
  other vias: 40.63,291.11 38.73,287.94 42.54,287.94 42.54,291.11 38.73,291.11
  pour Bottom (isolate 0.203): -1.27,-3.53 84.45,-3.53 84.45,298.73 -1.27,298.73
GPIO0  (via drill 0.25)
  Top 0.305: Q2.3 63.33,270.96 v62.86,271.43 | v50.8,280.95 50.58,280.73 X2.25
  Bottom 0.305: v62.86,271.43 58.8,271.43 56.26,273.96 56.26,280.06 55.37,280.95 v50.8,280.95
IO13_A12
  Top 0.406: X2.16 36.19,279.08 R10.1
IO21  (via drill 0.35)
  Top 0.305: X2.33 49.74,290.89 50.8,289.84 v52.7,289.84
  Bottom 0.305: v52.7,289.84 55.24,289.84 TP4.TP
MISO  (via drill 0.35)
  Top 0.305: X2.31 52.48,288.35 v52.7,288.57
  Bottom 0.305: v52.7,288.57 55.88,288.57 TP3.TP
MOSI  (via drill 0.35)
  Top 0.305: X2.30 52.48,287.08 v52.7,287.3
  Bottom 0.305: v52.7,287.3 56.51,287.3 TP2.TP
N$1
  Top 0.305: U7.1 58.91,227.92 58,227 20,227 19,226 19,210.63 U8.3
N$2
  Top 0.305: U9.3 56.64,213 24,213 23,212 23,210 22.45,209.45 U8.1
N$3
  Top 0.305: U23.1 74.91,67.91 74,67 12,67 11,66 11,44.63 U24.3
N$4
  Top 0.305: U24.1 14.45,43.45 15,44 15,46 16,47 66,47 67.09,45.91 U25.3
N$5
  Top 0.305: U25.1 68.91,42.92 67,41 40,41 39,40 39,13.63 U26.3
N$6
  Top 0.305: J3.B5 22.9,267.43 23.11,267.49 23.62,267.49 24.12,266.98 R4.1
N$7  (via drill 0.35)
  Top 0.61: D2.C 24.76,277.72 | 24.76,277.72 v24.76,277.77 | D6.C 24.76,277.72
  Bottom 0.61: U5.2 22.95,242.95 26.03,246.03 26.03,276.5 v24.76,277.77
N$8  (via drill 0.35)
  Top 0.305: J3.A5 18.54,269.39 18.16,269.01 v18.16,267.23 | R2.1 v24.12,265.07
  Bottom 0.305: v18.16,267.23 21.33,267.23 23.49,265.07 v24.12,265.07
N$9
  Top 0.305: U22.1 8.45,69.45 9,70 9,72 10,73 72,73 73.09,71.91 U23.3
N$10
  Bottom 0.813: U28.2 54.87,90.08 55.24,90.45 U29.1
N$11
  Bottom 0.813: U27.2 U28.1
N$26
  Top 0.305: R9.2 53.97,290.69 53.97,280.95 52.06,279.05 U1.2
N$28  (via drill 0.35)
  Top 0.305: U1.5 v48.26,266.98 48.89,266.35 52.37,266.35 55.54,269.52 U4.5 | J3.A6 22.09,269.27 22.47,269.27 22.73,269.01 22.73,268.88 | J3.B6 22.6,268.38 22.73,268.5 22.73,268.88 | v32.38,265.71 31.74,265.71 28.57,268.88 22.73,268.88
  Bottom 0.305: v32.38,265.71 46.98,265.71 v48.26,266.98
N$29  (via drill 0.35)
  Top 0.305: v32.38,266.98 31.94,266.98 29.01,269.9 22.6,269.9 J3.B7 19.17,269.01 19.05,268.88 19.05,268.5 19.43,268.12 19.68,268.12 J3.A7 | U1.6 v46.98,267.62 46.98,266.35 47.62,265.71 52.7,265.71 55.86,268.87 U4.6
  Bottom 0.305: v32.38,266.98 46.35,266.98 v46.98,267.62
N$30
  Top 0.305: R8.2 60.95,261.9 62.59,263.53 Q1.1
N$31
  Top 0.305: R6.2 60.95,263.81 61.59,264.44 61.59,266.98 62.23,267.62 62.23,269.52 61.27,270.47 Q2.1
N$32
  Top 0.305: R11.2 54.61,293.01 54.82,292.8 54.82,269.74 52.7,267.62 51.43,267.62 50.8,268.25 U1.3
N$33
  Top 0.406: D3.A 35.99,274.19 R10.2
N$35
  Top 0.305: D5.C 24.34,261.9 R13.1
N$36
  Top 0.305: D1.C 23.07,296.62 R14.1
N$38
  Top 0.305: U7.3 57.09,230.92 56,232 24.54,232 24,231.47 24,230 23.45,229.45 U6.1
N$40
  Top 0.305: U9.1 60.91,208.92 60,208 18,208 17,207 17,190.63 U10.3
N$41
  Top 0.305: U11.3 61.09,191.92 60,193 22,193 21,192 21,190 20.45,189.45 U10.1
N$42
  Top 0.305: U11.1 62.91,187.92 62,187 16,187 15,186 15,170.63 U12.3
N$43
  Top 0.305: U12.1 18.45,169.45 19,170 19,172 20,173 62,173 63.09,171.91 U13.3
N$44
  Top 0.305: U13.1 64.91,167.91 64,167 14,167 13,166 13,150.63 U14.3
N$45
  Top 0.305: U14.1 16.45,149.45 17,150 17,152 18,153 64,153 65.09,151.91 U15.3
N$46
  Top 0.305: U15.1 66.91,147.91 66,147 12,147 11,146 11,130.63 U16.3
N$47
  Top 0.305: U16.1 14.45,129.45 15,130 15,132 16,133 66,133 67.09,131.91 U17.3
N$48
  Top 0.305: U17.1 69,129.37 69,128 68,127 10,127 9,126 9,111.47 9.09,111.38 U18.3
N$49
  Top 0.305: U19.3 69.09,111.91 68,113 14,113 13,112 13,110 12.45,109.45 U18.1
N$50
  Top 0.305: U19.1 70.91,107.91 70,107 8,107 7,106 7,90.63 U20.3
N$51
  Top 0.305: U20.1 10.45,89.45 11,90 11,92 12,93 70,93 71.09,91.91 U21.3
N$52
  Top 0.305: U21.1 72.91,86.65 70.37,84.1 6.98,84.1 5,82.12 5,70.63 U22.3
NEOPIX3V3  (via drill 0.25)
  Top 0.305: X2.9 30.74,287.08 29.62,287.08 29.2,286.67 v29.2,286.03 | U6.3 21.03,230.61 v21.03,233.15
  Bottom 0.305: v29.2,286.03 29.84,285.39 29.84,241.96 v21.03,233.15
RESET  (via drill 0.25)
  Top 0.305: SW2.B' v40,263.97 SW2.B 37.9,264.02 C31.1 31.53,264.02 v31.11,264.44 | R5.2 56.3,266.76 v55.24,265.71 55.88,265.07 Q1.3 | X2.3 30.89,294.7 v30.48,294.29
  Bottom 0.305: v40,263.97 48.42,263.97 50.16,265.71 v55.24,265.71 | v30.48,294.29 31.11,293.65 v31.11,264.44
RTS  (via drill 0.25)
  Top 0.305: U1.14 50.8,263.17 51.43,262.53 53.97,262.53 v54.61,263.17 55.24,263.81 R6.1 | v62.86,266.98 62.59,266.71 Q1.2
  Bottom 0.305: v54.61,263.17 60.95,263.17 62.86,265.07 v62.86,266.98
RXD0
  Top 0.305: X2.34 49.74,292.16 50.8,291.11 R9.1
SAO_IO1  (via drill 0.35)
  Top 0.406: X2.27 52.48,283.27 v52.7,283.49 | J2.5 42.29,242.13 v42.29,243.1
  Bottom 0.406: v52.7,283.49 55.88,283.49 57.02,282.35 57.02,274.35 59.05,272.31 64.13,272.31 65.4,269.01 63.37,261.14 63.37,246.91 59.56,243.1 v42.29,243.1
SAO_IO2  (via drill 0.35)
  Top 0.406: X2.28 52.48,284.54 v52.7,284.76 | J2.6 45.08,237.64 v45.08,238.02
  Bottom 0.406: v52.7,284.76 56,284.76 58.03,282.73 58.03,274.35 59.3,273.08 64.64,273.08 66.42,268.76 64.38,261.14 64.38,246.66 60.07,242.34 49.4,242.34 v45.08,238.02
SCK  (via drill 0.35)
  Top 0.305: X2.29 52.48,285.81 v52.7,286.03
  Bottom 0.305: TP1.TP v52.7,286.03
SCL
  Top 0.406: X2.36 56.09,294.7 57.17,293.62 57.17,274.35 58.8,272.72 64.32,272.72 65.88,269.09 63.5,259.7 63.5,246.66 59.69,242.85 46.35,242.85 45.08,244.12 40,244.12 37.46,241.58 37.46,239.97 J2.4
SDA
  Top 0.406: X2.37 56.09,295.97 57.78,294.29 57.78,275.24 59.69,273.33 64.77,273.33 66.57,269.12 64.13,259.36 64.13,246.03 60.32,242.22 46.35,242.22 43.17,239.04 40.34,239.04 J2.3
TXD0
  Top 0.305: X2.35 50.38,293.43 50.8,293.01 R11.1
VBAT  (via drill 0.35)
  Top 0.61: R1.2 v26.03,289.84 | D2.A 27.24,272.75 v27.3,272.69
  Bottom 0.61: v26.03,289.84 25.39,289.2 25.39,286.03 27.3,284.12 v27.3,272.69 27.3,241.58 22.22,236.5 15.87,236.5 14.6,235.23 4.9,103.32 12.38,95.85 12.7,95.53 23.49,95.53 24.76,94.26 U27.1
VBUS  (via drill 0.25, 0.35)
  Top 0.305: U4.4 56.21,271.09 v55.88,271.43 | 23.17,271.74 24.12,270.79 v32.38,270.79
  Top 0.356: J3.B4/A9 17.68,266.44 17.27,266.85 17.27,269.65 18.1,270.48 19.53,270.48 20.14,271.09 J3.A4/B9
  Top 0.508: J3.A4/B9 21.84,271.43 22.86,271.43 23.17,271.74 23.49,272.06 D6.A
  Bottom 0.305: v55.88,271.43 33.02,271.43 v32.38,270.79
VDD  (via drill 0.35, 0.4)
  Top 0.305: D5.A 27.71,262.12 v28.57,261.26
  Top 0.406: U2.1 26.56,282.54 R7.2 C8.1 v28.57,280.95
  Bottom 0.61: v28.57,280.95 v28.57,261.26 v28.57,258.09 | U5.1 20.67,239.96 v20.95,239.68
  pour Top (isolate 0.203): -4.45,259.74 -4.45,-0.99 81.91,-0.99 81.91,259.74

### Text on the board
tPlace: FLAG-Z35XD8URP3 | SAO
bPlace: NORTHSEC2023 | 1 / 2 / 3 / 4 | + | + | FLAG-4XZRY8H3DK | 3x AAA / Input: 4.5V | +
tDocu: CHANGE LOG V3e -> V3f / - move switch / - added level converter / - added flags / / V3f -> V3g / - added Vdd and 3V3 LED status / / V3g -> V3h / - updated LEDVDD to 3.3V / - added test points on SPI / / V3h -> V3i / - rollback LEDVDD to 5V / - replaced level-converter to BSS138 / / V3i -> V3j / - corrected vBat thickness / - added thicker GND trace at bat. / - aesthetic adjustment
Stiffner: Stiffener BOT | Note: / Flexible PCB 0.2mm FPC / Stiffener 0.8mm FR4 | STIFFNER CUTOUT / FOR SWITCH | Stiffener BOT | Stiffener BOT | Stiffener BOT | Stiffener BOT | Stiffener BOT | Stiffener BOT | Stiffener BOT | Stiffener BOT